# EAGLE design main (EAGLE 5.11)
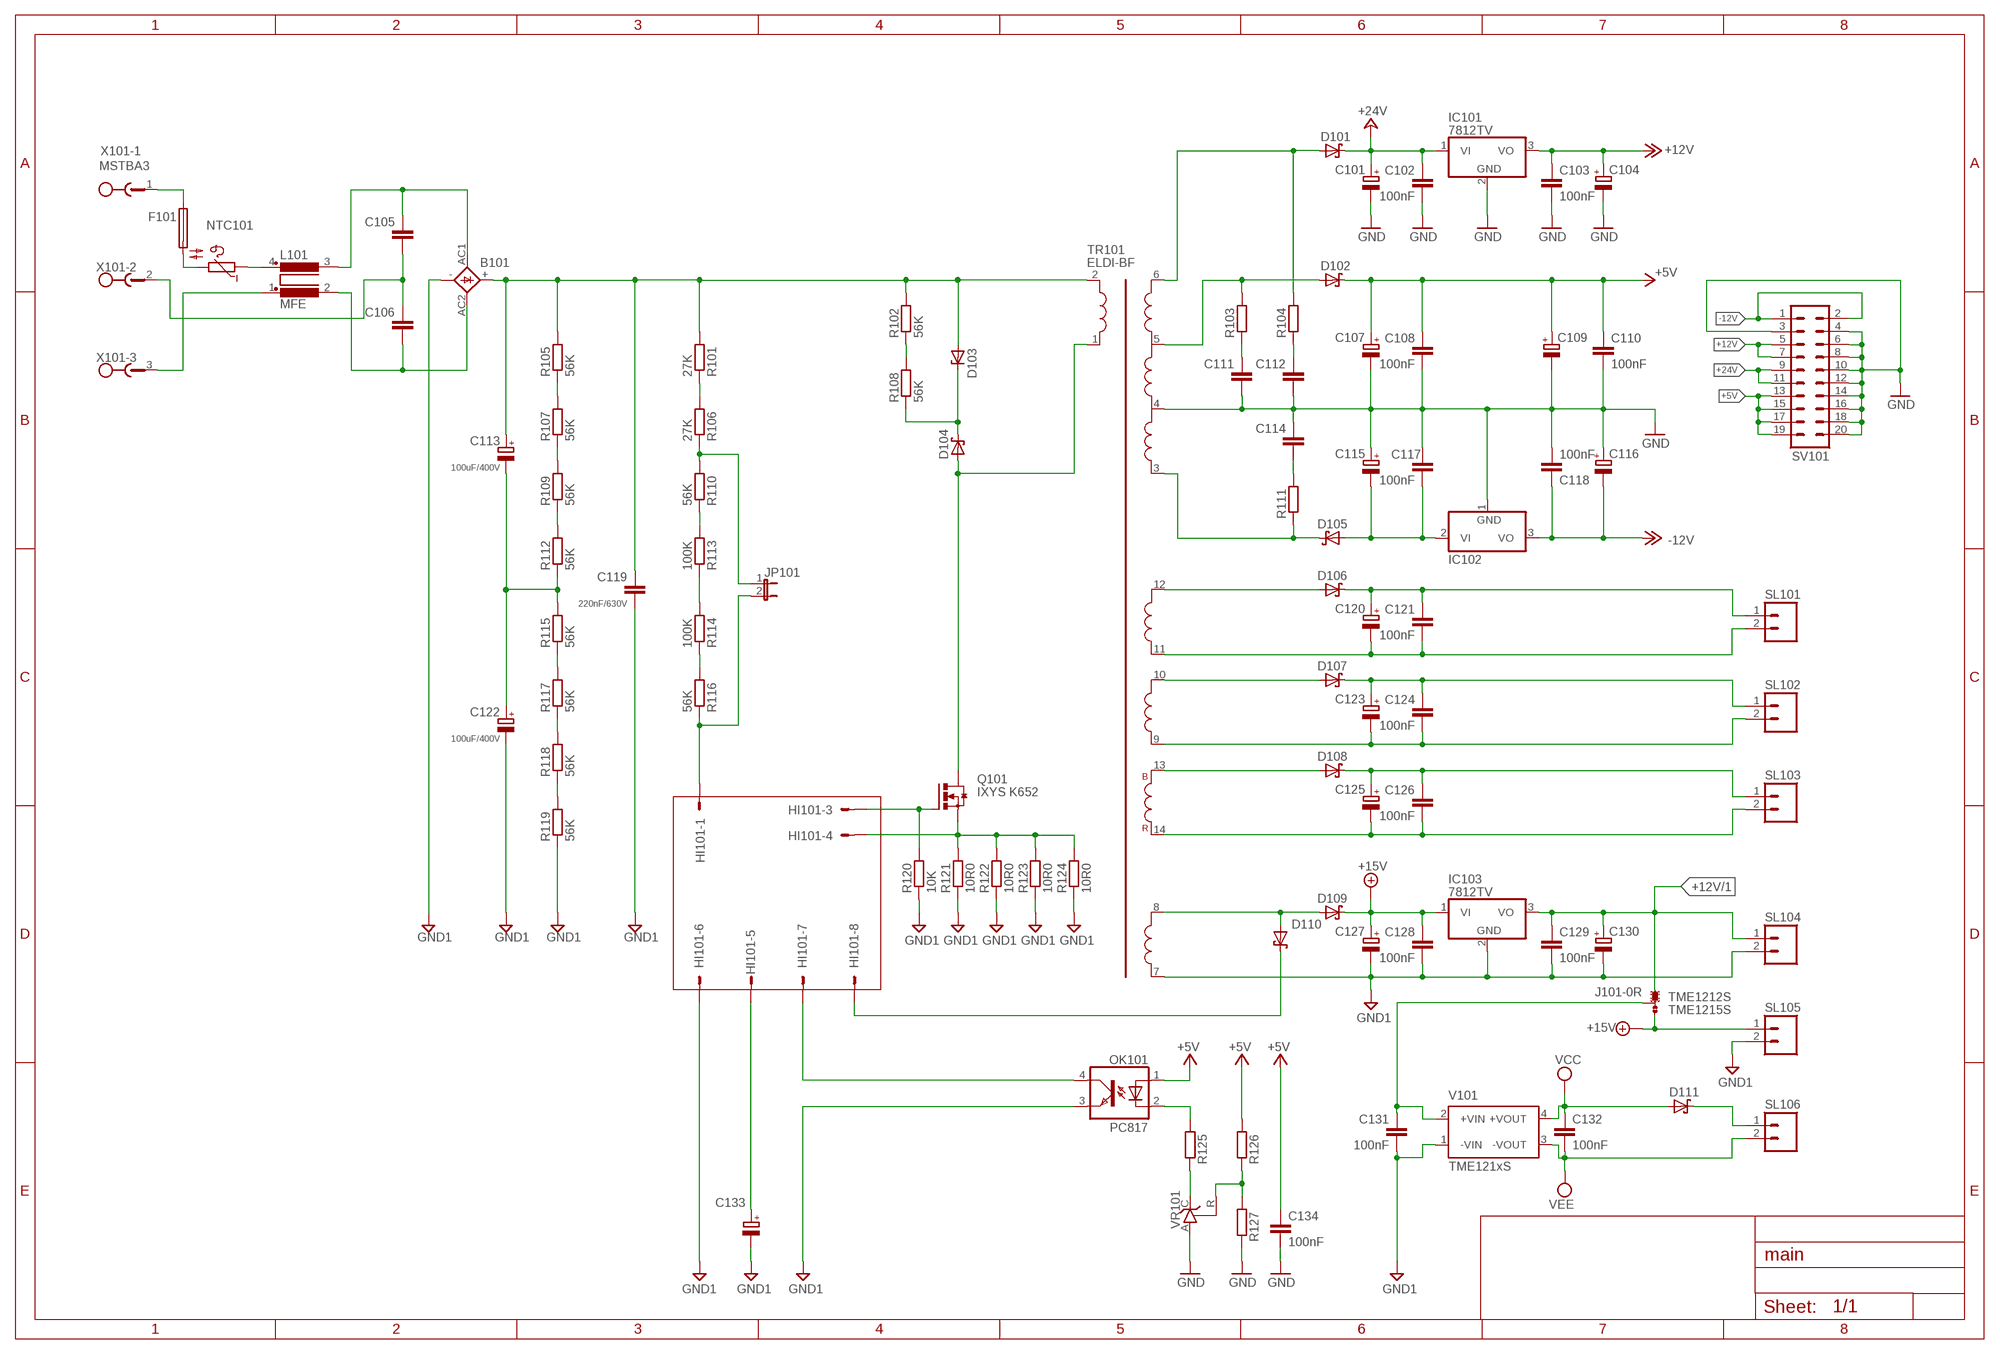
[diagram p0: schematic, sheet 1]

## Parts
B101  KBU  [KBU]
C101  CPOL-EUE3.5-10  [E3,5-10]
C102  100nF  C-EUC1206  [C1206]
C103  100nF  C-EUC1206  [C1206]
C104  CPOL-EUE3.5-10  [E3,5-10]
C105  C-EU102-054X133  [C102-054X133]
C106  C-EU102-054X133  [C102-054X133]
C107  CPOL-EUE3.5-10  [E3,5-10]
C108  100nF  C-EUC1206  [C1206]
C109  CPOL-EUE3.5-10  [E3,5-10]
C110  100nF  C-EUC1206  [C1206]
C111  C-EUC1206  [C1206]
C112  C-EUC1206  [C1206]
C113  100uF/400V  CPOL-EUE7.5-18  [E7,5-18]
C114  C-EUC1206  [C1206]
C115  CPOL-EUE3.5-10  [E3,5-10]
C116  CPOL-EUE3.5-10  [E3,5-10]
C117  100nF  C-EUC1206  [C1206]
C118  100nF  C-EUC1206  [C1206]
C119  220nF/630V  C-EU225-062X268  [C225-062X268]
C120  CPOL-EUE3.5-8  [E3,5-8]
C121  100nF  C-EUC1206  [C1206]
C122  100uF/400V  CPOL-EUE7.5-18  [E7,5-18]
C123  CPOL-EUE3.5-8  [E3,5-8]
C124  100nF  C-EUC1206  [C1206]
C125  CPOL-EUE3.5-8  [E3,5-8]
C126  100nF  C-EUC1206  [C1206]
C127  CPOL-EUE3.5-8  [E3,5-8]
C128  100nF  C-EUC1206  [C1206]
C129  100nF  C-EUC1206  [C1206]
C130  CPOL-EUE3.5-8  [E3,5-8]
C131  100nF  C-EUC1206  [C1206]
C132  100nF  C-EUC1206  [C1206]
C133  CPOL-EUE3.5-8  [E3,5-8]
C134  100nF  C-EUC1206  [C1206]
D101  SCHOTTKY-DIODESMD  [SMB]
D102  SCHOTTKY-DIODESMD  [SMB]
D103  ZENER-DIODESMB  [SMB]
D104  SCHOTTKY-DIODESMD  [SMB]
D105  SCHOTTKY-DIODESMD  [SMB]
D106  SCHOTTKY-DIODESMD  [SMB]
D107  SCHOTTKY-DIODESMD  [SMB]
D108  SCHOTTKY-DIODESMD  [SMB]
D109  SCHOTTKY-DIODESMD  [SMB]
D110  SCHOTTKY-DIODESMD  [SMB]
D111  SCHOTTKY-DIODESMD  [SMB]
F101  GSH15  [GSH15]
HI101  M08S  [08P]
IC101  7812TV  [TO220V]
IC102  7912T  [TO220H]
IC103  7812TV  7805TV  [TO220V]
J101  0R-JUMPA  [A0R-JMP]
JP101  JP1E  [JP1]
L101  MFE  [MFE]
NTC101  B57164  [B57164]
OK101  PC817  [DIL04]
Q101  IXYS K652  IRF3704S  [D2PACK]
R101  27K  R-EU_R1206  [R1206]
R102  56K  R-EU_R1206  [R1206]
R103  R-EU_R1206  [R1206]
R104  R-EU_R1206  [R1206]
R105  56K  R-EU_R1206  [R1206]
R106  27K  R-EU_R1206  [R1206]
R107  56K  R-EU_R1206  [R1206]
R108  56K  R-EU_R1206  [R1206]
R109  56K  R-EU_R1206  [R1206]
R110  56K  R-EU_R1206  [R1206]
R111  R-EU_R1206  [R1206]
R112  56K  R-EU_R1206  [R1206]
R113  100K  R-EU_R1206  [R1206]
R114  100K  R-EU_R1206  [R1206]
R115  56K  R-EU_R1206  [R1206]
R116  56K  R-EU_R1206  [R1206]
R117  56K  R-EU_R1206  [R1206]
R118  56K  R-EU_R1206  [R1206]
R119  56K  R-EU_R1206  [R1206]
R120  10K  R-EU_R1206  [R1206]
R121  10R0  R-EU_R1206  [R1206]
R122  10R0  R-EU_R1206  [R1206]
R123  10R0  R-EU_R1206  [R1206]
R124  10R0  R-EU_R1206  [R1206]
R125  R-EU_R1206  [R1206]
R126  R-EU_R1206  [R1206]
R127  R-EU_R1206  [R1206]
SL101  M02  [02P]
SL102  M02  [02P]
SL103  M02  [02P]
SL104  M02  [02P]
SL105  M02  [02P]
SL106  M02  [02P]
SV101  ML20  [ML20]
TR101  ELDI-BF  TRAF-ELDY-BFVAR1  [TRAF-ELDI-BF-VAR1]
V101  TME121xS  TME1215S  [TME]
VR101  TL431CLP  [TO92-CLP]
X101  MSTBA3  [MSTBA3]

## Nets
+5V: C107.+ C108.1 C109.+ C110.1 C134.1 D102.C OK101.1(A) R126.2 SV101.13 SV101.15 SV101.17 SV101.19
+12V: C103.1 C104.+ IC101.3(VO) SV101.5 SV101.7
+12V/1: C129.1 C130.+ IC103.3(VO) J101.1 SL104.1
+15V: C127.+ C128.1 D109.C IC103.1(VI) J101.3 SL105.1
+24V: C101.+ C102.1 D101.C IC101.1(VI) SV101.9 SV101.11
-12V: C116.- C118.1 IC102.3(VO) SV101.1 SV101.2
GND: C101.- C102.2 C103.2 C104.- C107.- C108.2 C109.- C110.2 C111.2 C112.2 C114.1 C115.+ C116.+ C117.2 C118.2 C134.2 IC101.2(GND) IC102.1(GND) R127.1 SV101.3 SV101.4 SV101.6 SV101.8 SV101.10 SV101.12 SV101.14 SV101.16 SV101.18 SV101.20 TR101.4 VR101.A
GND1: B101.- C119.2 C122.- C127.- C128.2 C129.2 C130.- C131.2 C133.- HI101.6 IC103.2(GND) OK101.3(EMIT) R119.1 R120.1 R121.1 R122.1 R123.1 R124.1 SL104.2 SL105.2 TR101.7 V101.1(-VIN)
N$1: F101.1 X101.1
N$2: L101.4 NTC101.1
N$3: L101.1 X101.3
N$4: B101.+ C113.+ C119.1 D103.A R101.2 R102.2 R105.2 TR101.2
N$6: C113.- C122.+ R112.1 R115.2
N$9: C115.- C117.1 D105.A IC102.2(VI)
N$10: D105.C R111.1 TR101.3
N$11: D101.A R104.2 TR101.6
N$12: R109.1 R112.2
N$13: D102.A R103.2 TR101.5
N$14: B101.AC2 C106.2 L101.2
N$15: B101.AC1 C105.1 L101.3
N$16: C114.2 R111.2
N$17: C111.1 R103.1
N$18: C112.1 R104.1
N$19: HI101.4 Q101.3(S) R121.2 R122.2 R123.2 R124.2
N$20: HI101.3 Q101.1(G) R120.2
N$21: D104.A Q101.2(D) TR101.1
N$22: D103.C D104.C R108.1
N$23: C105.2 C106.1 X101.2
N$24: R102.1 R108.2
N$25: D109.A D110.A TR101.8
N$26: D108.A TR101.13
N$27: D106.A TR101.12
N$28: R107.1 R109.2
N$30: D110.C HI101.8
N$32: D107.A TR101.10
N$33: R125.1 VR101.C
N$34: OK101.2(C) R125.2
N$35: R126.1 R127.2 VR101.R
N$36: JP101.1 R106.1 R110.2
N$37: HI101.7 OK101.4(COL)
N$38: R105.1 R107.2
N$39: R113.1 R114.2
N$40: R114.1 R116.2
N$41: R110.1 R113.2
N$42: HI101.1 JP101.2 R116.1
N$43: R101.1 R106.2
N$46: F101.2 NTC101.2
N$61: R115.1 R117.2
N$62: R117.1 R118.2
N$63: R118.1 R119.2
N$64: C133.+ HI101.5
N$83: C131.1 J101.2 V101.2(+VIN)
N$84: D111.C SL106.1
U+: C120.+ C121.1 D106.C SL101.1
U_GND: C120.- C121.2 SL101.2 TR101.11
V+: C123.+ C124.1 D107.C SL102.1
V_GND: C123.- C124.2 SL102.2 TR101.9
VCC: C132.1 D111.A V101.4(+VOUT)
VEE: C132.2 SL106.2 V101.3(-VOUT)
W+: C125.+ C126.1 D108.C SL103.1
W_GND: C125.- C126.2 SL103.2 TR101.14
Unconnected: HI101.2

## Notes on the sheet
- TME1212S
- TME1215S

## Library data of the parts
B101 = rectifier:KBU: DIOTEC RECTIFIER
C101 C104 C107 C109 C113 C115 C116 C120 C122 C123 C125 C127 C130 C133 = rcl:CPOL-EU: POLARIZED CAPACITOR, European symbol
C102 C103 C105 C106 C108 C110-C112 C114 C117-C119 C121 C124 C126 C128 C129 C131 C132 C134 = rcl:C-EU: CAPACITOR, European symbol
D101 D102 D104-D111 = diode:SCHOTTKY-DIODE: Schottky Diode
D103 = diode:ZENER-DIODE: Z-Diode
F101 = fuse:GSH15: FUSE HOLDER grid 15mm, 19649 Wickmann; MPN: 64900001039; OC_FARNELL: 1271673; OC_NEWARK: 02P0318
HI101 = con-amp-quick:M08S: AMP QUICK CONNECTOR; OC_FARNELL: unknown; OC_NEWARK: unknown
IC101 IC103 = linear:78*: Positive VOLTAGE REGULATOR Source: http://cache.national.com/ds/LM/LM78L05.pdf http://www.fairchildsemi.com/ds/LM/LM7805.pdf
IC102 = linear:79*: Negative VOLTAGE REGULATOR
J101 = jump-0r-smd:0R-JUMP: SMD 0R 0805 Jumper
JP101 = jumper:JP1E: JUMPER
L101 = inductors:MFE: FILTER
NTC101 = ptc-ntc:B57164: SIEMENS NTC; MPN: B57164K474K52; OC_FARNELL: 9753451; OC_NEWARK: 29M3118
OK101 = optocoupler:PC817: SHARP OPTO COUPLER; MPN: PC817X4J000F; OC_FARNELL: 9707727; OC_NEWARK: 97K7059
Q101 = transistor-power:IRF3704: SMPS MOSFET HEXFET® Power MOSFET Source: http://www.irf.com/product-info/datasheets/data/irf3704.pdf
R101-R127 = rcl:R-EU_: RESISTOR, European symbol
SL101-SL106 = con-amp-quick:M02: AMP QUICK CONNECTOR; OC_FARNELL: unknown; OC_NEWARK: unknown
SV101 = con-harting-ml:ML20: HARTING; OC_FARNELL: unknown; OC_NEWARK: unknown
TR101 = electroinvent:TRAF-ELDY-BF
V101 = traco-electronic:TME?*: DC/DC Converter TME Series 1 Watt Source: www.tracopower.com .. tme.pdf; MPN: TME 1215S; OC_FARNELL: 1007546; OC_NEWARK: 51R5328
VR101 = v-reg:TL431CLP: VOLTAGE REGULATOR
X101 = con-phoenix-508:MSTBA3: PHOENIX; MF: FARNELL; MPN: 1757255; OC_FARNELL: 3705183; OC_NEWARK: 71C4162

## Board
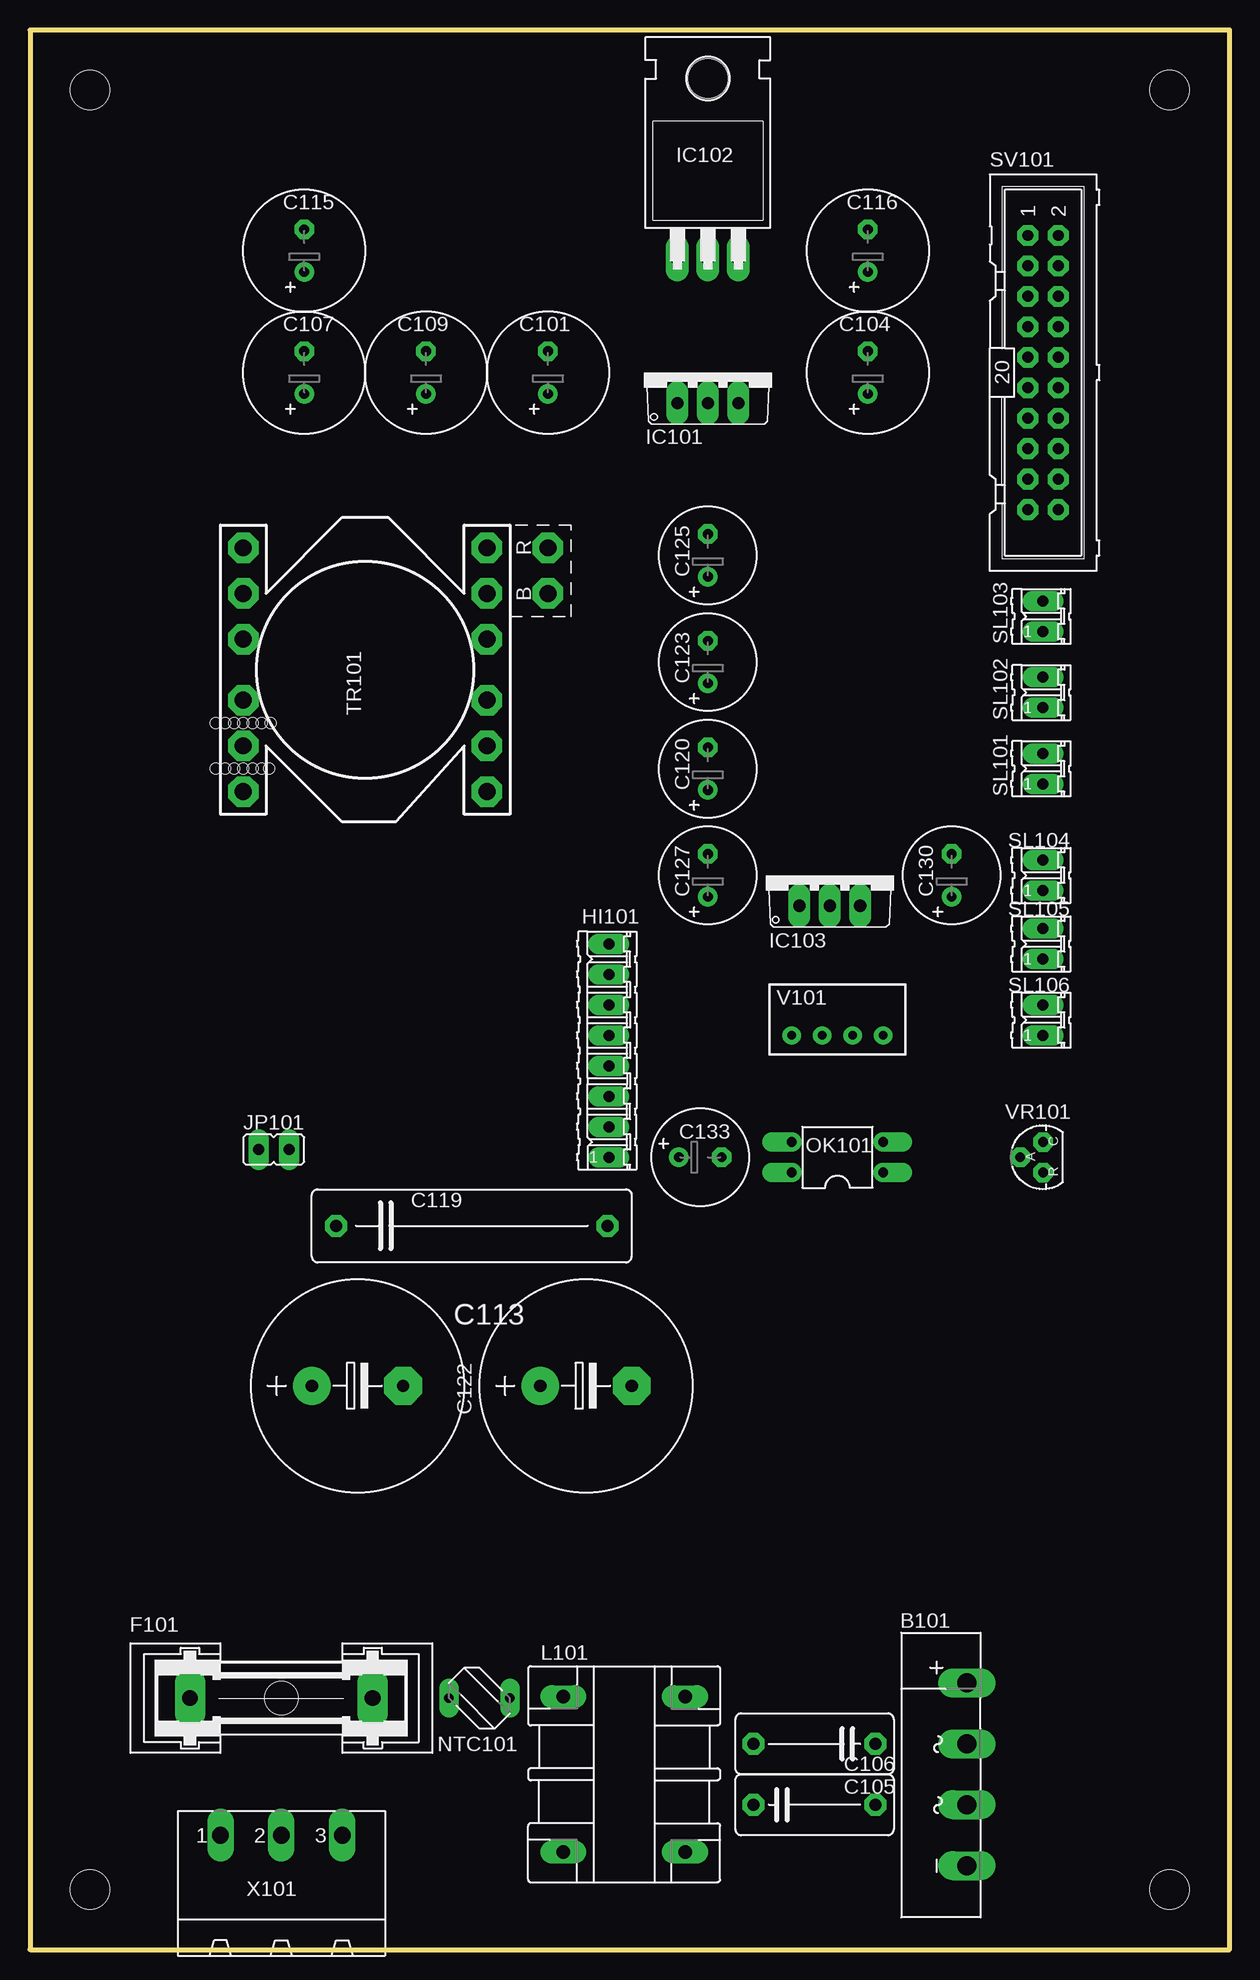
[diagram p1: board, top side]
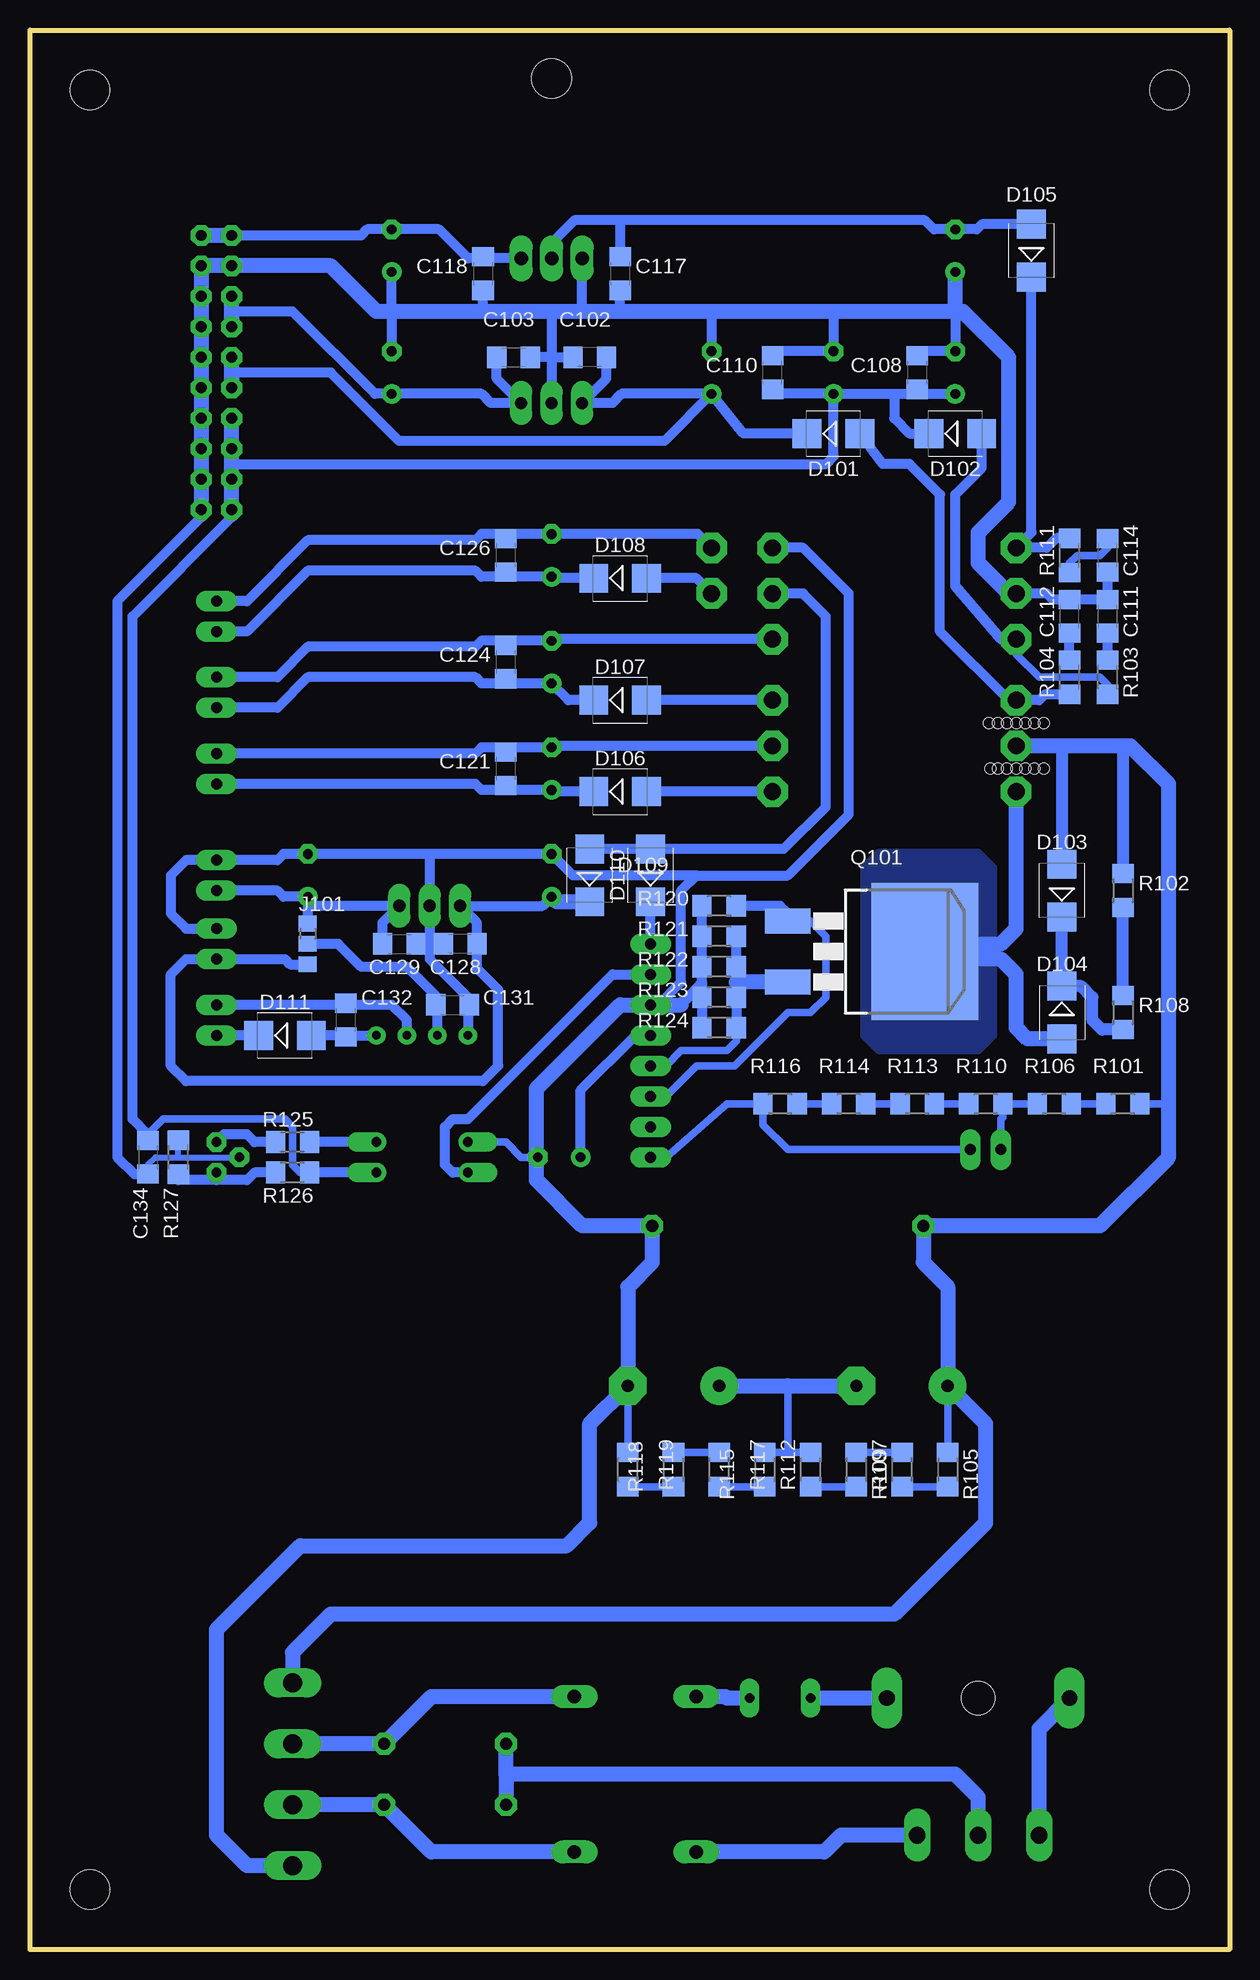
[diagram p2: board, bottom side, seen from below]

Size 100 x 160 mm. Coordinates in mm from the lower left corner, seen from the top.
Outline: 0,0 100,0 100,160 0,160 0,0
Copper layers (1*16): Top 0.035mm / dielectric 1.5mm / Bottom 0.035mm
Design rules "default *": minimum track width 10mil, minimum drill 0.9mm, track to track 8mil, track to pad 8mil, pad to pad 8mil, via to via 8mil, smd to smd 8mil, copper to edge 40mil, drill to drill 8mil, minimum pad ring 16mil, minimum via ring 10mil, stop-mask expansion 4mil, vias tented up to drill 0mil, thermal gap 10mil
Holes 0.9 mm at 17.78,102.23 17.02,102.23 18.54,102.23 19.3,102.23 20.07,102.23 16.26,102.23 15.49,102.23 17.78,98.42 17.02,98.42 16.26,98.42 15.49,98.42 18.54,98.42 19.3,98.42 19.94,98.42
Holes 3.3 mm at 5,5 95,5 95,155 5,155

### Footprints (pad centres in the part's own frame; a part is rotated, then mirrored left to right if it is on the bottom)
KBU = drill 1.6 long: + -7.62,2.54; - 7.62,2.54; AC1 -2.54,2.54; AC2 2.54,2.54
E3,5-10 = drill 0.813 pad 1.6 round: + -1.778,0 | drill 0.813 pad 1.6 octagon: - 1.778,0
C1206 = smd 1.6 x 1.8: 1 -1.4,0; 2 1.4,0
C102-054X133 = drill 1.016 octagon: 1 -5.08,0; 2 5.08,0
E7,5-18 = drill 1.016 pad 3.15 round: + -3.81,0 | drill 1.016 pad 3.15 octagon: - 3.81,0
C225-062X268 = drill 1.016 octagon: 1 -11.303,0; 2 11.303,0
E3,5-8 = drill 0.813 pad 1.6 round: + -1.778,0 | drill 0.813 pad 1.6 octagon: - 1.778,0
SMB = smd 2.4 x 2.4: A 2.2,0; C -2.2,0
GSH15 = drill 1.321 pad 2.54 long: 1 -7.62,0; 2 7.62,0 | hole 2.794: 0,0
08P = drill 0.914 long: 1 -8.89,0; 2 -6.35,0; 3 -3.81,0; 4 -1.27,0; 5 1.27,0; 6 3.81,0; 7 6.35,0; 8 8.89,0
TO220V = drill 1.016 long: 1 -2.54,-2.54; 2 0,-2.54; 3 2.54,-2.54
TO220H = drill 1.118 long: 1 -2.54,-10.16; 2 0,-10.16; 3 2.54,-10.16 | hole 3.302: 0,4.826
A0R-JMP = smd 1.5 x 1.3: 1 0,1.7; 2 0,0; 3 0,-1.7
JP1 = drill 0.914 long: 1 0,-1.27; 2 0,1.27
MFE = drill 1.118 long: 1 6.477,-5.08; 2 6.477,5.08; 3 -6.477,5.08; 4 -6.477,-5.08
B57164 = drill 0.813 long: 1 -2.54,0; 2 2.54,0
DIL04 = drill 0.813 offset: 1 -1.27,-3.81; 2 1.27,-3.81; 3 1.27,3.81; 4 -1.27,3.81
D2PACK = smd 2.083 x 3.81: 1 -2.54,-8.89; 3 2.54,-8.89 | smd 11.43 x 8.89: 2 0,2.54
R1206 = smd 1.6 x 1.803: 1 -1.422,0; 2 1.422,0
02P = drill 0.914 long: 1 -1.27,0; 2 1.27,0
ML20 = drill 0.914 octagon: 1 -11.43,-1.27; 2 -11.43,1.27; 3 -8.89,-1.27; 4 -8.89,1.27; 5 -6.35,-1.27; 6 -6.35,1.27; 7 -3.81,-1.27; 8 -3.81,1.27; 9 -1.27,-1.27; 10 -1.27,1.27; 11 1.27,-1.27; 12 1.27,1.27; 13 3.81,-1.27; 14 3.81,1.27; 15 6.35,-1.27; 16 6.35,1.27; 17 8.89,-1.27; 18 8.89,1.27; 19 11.43,-1.27; 20 11.43,1.27
TRAF-ELDI-BF-VAR1 = drill 1.4 octagon: 1 -10.16,10.16; 2 -6.35,10.16; 3 10.16,10.16; 4 6.35,10.16; 5 2.54,10.16; 6 -2.54,10.16; 7 10.16,-10.16; 8 6.35,-10.16; 9 2.54,-10.16; 10 -2.54,-10.16; 11 -6.35,-10.16; 12 -10.16,-10.16; 13 6.35,-15.24; 14 10.16,-15.24
TME = drill 0.7 pad 1.1 round: 1 -3.81,0; 2 -1.27,0; 3 1.27,0; 4 3.81,0
TO92-CLP = drill 0.813 octagon: A 0,1.905; C 1.27,0; R -1.27,0
MSTBA3 = drill 1.397 long: 1 -5.08,5.08; 2 0,5.08; 3 5.08,5.08

### Placement (x,y rotation side)
B101  75.56,14.61 270 top
C101  43.18,131.44 90 top
C102  53.34,132.72 180 bottom
C103  59.69,132.72 0 bottom
C104  69.85,131.44 90 top
C105  65.41,17.14 180 top
C106  65.41,12.06 0 top
C107  22.86,131.44 90 top
C108  26.04,131.44 90 bottom
C109  33.02,131.44 90 top
C110  38.1,131.44 90 bottom
C111  10.16,111.12 90 bottom
C112  13.34,111.12 90 bottom
C113  27.3,46.99 0 top
C114  10.16,116.2 90 bottom
C115  22.86,141.6 90 top
C116  69.85,141.6 90 top
C117  50.8,139.7 270 bottom
C118  62.23,139.7 270 bottom
C119  36.83,60.33 0 top
C120  56.52,98.42 90 top
C121  60.33,98.42 90 bottom
C122  46.35,46.99 0 top
C123  56.52,107.31 90 top
C124  60.33,107.31 90 bottom
C125  56.52,116.2 90 top
C126  60.33,116.2 90 bottom
C127  56.52,89.53 90 top
C128  64.14,83.82 180 bottom
C129  69.22,83.82 0 bottom
C130  76.83,89.53 90 top
C131  64.77,78.74 0 bottom
C132  73.66,77.47 90 bottom
C133  55.88,66.04 0 top
C134  90.17,66.04 270 bottom
D101  33.02,126.36 0 bottom
D102  22.86,126.36 0 bottom
D103  13.97,88.27 90 bottom
D104  13.97,78.11 270 bottom
D105  16.51,141.6 90 bottom
D106  50.8,96.52 0 bottom
D107  50.8,104.14 0 bottom
D108  50.8,114.3 0 bottom
D109  53.34,89.53 90 bottom
D110  48.26,89.53 90 bottom
D111  78.74,76.2 0 bottom
F101  20.95,20.95 0 top
HI101  48.26,74.93 90 top
IC101  56.52,131.44 0 top
IC102  56.52,151.13 0 top
IC103  66.67,89.53 0 top
J101  76.83,83.82 0 bottom
JP101  20.32,66.67 270 top
L101  49.53,14.61 270 top
NTC101  37.47,20.95 180 top
OK101  67.31,66.04 90 top
Q101  27.94,83.19 270 bottom
R101  8.89,70.48 0 bottom
R102  8.89,88.27 90 bottom
R103  10.16,106.05 270 bottom
R104  13.34,106.05 270 bottom
R105  23.5,40.01 90 bottom
R106  14.61,70.48 0 bottom
R107  27.3,40.01 270 bottom
R108  8.89,78.11 90 bottom
R109  31.11,40.01 90 bottom
R110  20.32,70.48 0 bottom
R111  13.34,116.2 270 bottom
R112  34.92,40.01 270 bottom
R113  26.04,70.48 0 bottom
R114  31.75,70.48 0 bottom
R115  38.73,40.01 90 bottom
R116  37.47,70.48 0 bottom
R117  42.55,40.01 270 bottom
R118  46.35,40.01 90 bottom
R119  50.16,40.01 270 bottom
R120  42.55,87 0 bottom
R121  42.55,84.45 0 bottom
R122  42.55,81.92 0 bottom
R123  42.55,79.38 0 bottom
R124  42.55,76.83 0 bottom
R125  78.11,67.31 0 bottom
R126  78.11,64.77 0 bottom
R127  87.63,66.04 270 bottom
SL101  84.45,98.42 90 top
SL102  84.45,104.78 90 top
SL103  84.45,111.12 90 top
SL104  84.45,89.53 90 top
SL105  84.45,83.82 90 top
SL106  84.45,77.47 90 top
SV101  84.45,131.44 270 top
TR101  27.94,106.68 90 top
V101  67.31,76.2 0 top
VR101  84.45,66.04 90 top
X101  20.95,4.45 0 top

### Tracks (layer width: path | path; a pad name or v marks a point on that pad's centre or on a via)
+5V
  Bottom 0.61: R126.2 77.47,64.77 78.11,65.41 78.11,68.58 78.74,69.22 88.9,69.22 90.17,67.94
  Bottom 0.813: 26.04,129.67 C107.+ | C109.+ 27.94,129.67 | 27.94,129.67 26.04,129.67 | C109.+ 37.72,129.67 C110.1 | 26.04,129.67 C108.1 | C109.+ 33.02,124.46 33.66,123.83 83.19,123.83 | SV101.19 83.19,119.38 91.44,111.12 91.44,69.22 90.17,67.94 C134.1 | OK101.1 R126.2 | D102.C 26.67,126.36 27.94,127.64 27.94,129.67
  Bottom 1.27: SV101.19 SV101.17 83.19,123.83 SV101.15 SV101.13
+12V
  Bottom 0.813: C103.1 61.09,130.94 IC101.3 61.59,128.91 62.36,129.67 C104.+ 71.25,129.67 78.11,136.53 83.19,136.53
  Bottom 1.27: SV101.5 SV101.7 83.19,136.53
+12V/1
  Bottom 0.813: C130.+ 76.71,87 IC103.3 70.61,85.59 C129.1 | C130.+ 78.87,87.76 79.38,88.27 SL104.1 | C130.+ J101.1
+15V
  Bottom 0.813: C127.+ 57.28,87 IC103.1 62.73,85.59 C128.1 62.73,81.78 60.96,80.01 60.96,73.66 62.23,72.39 87,72.39 88.27,73.66 88.27,81.28 87,82.55 SL105.1 78.74,82.55 78.31,82.12 J101.3
  Bottom 1.27: D109.C 56.09,87.33 C127.+
+24V
  Bottom 0.813: D101.C 40.51,126.36 C101.+ | C101.+ 50.67,129.67 51.44,128.91 IC101.1 51.94,130.94 C102.1 | C101.+ 47.12,125.73 69.22,125.73 74.93,131.44 83.19,131.44
  Bottom 1.27: SV101.9 SV101.11 83.19,131.44
-12V
  Bottom 0.813: IC102.3 62.23,140.97 | 62.23,140.97 63.5,140.97 65.91,143.38 C116.- 71.88,143.38 72.39,142.88 SV101.1 | 62.23,140.97 C118.1
  Bottom 1.27: SV101.1 SV101.2
GND  (via drill 1.4 pad 2.54)
  Bottom 0.508: 87.63,66.04 89.53,66.04 90.17,65.41 C134.2 | 87.63,66.04 VR101.A | 87.63,66.04 R127.1
  Bottom 0.813: C114.1 C111.2 C112.2 14.73,112.53 15.24,113.03 TR101.4 | C108.2 25.66,133.22 C107.- 22.86,136.53 | C110.2 37.72,133.22 C109.- 33.02,136.53 | 43.18,136.53 C101.- | 56.52,136.53 56.52,132.72 | 56.52,132.72 IC101.2 | 56.52,132.72 C102.2 | 56.52,132.72 C103.2 | C104.- 69.85,136.53 C116.+ | 53.98,136.53 IC102.1 | SV101.20 85.72,119.38 92.71,112.39 92.71,66.04 91.31,64.64 C134.2 | 50.8,136.53 C117.2 | 62.23,136.53 C118.2
  Bottom 1.27: TR101.4 18.41,113.03 20.95,115.57 20.95,118.11 18.41,120.65 18.41,132.72 22.23,136.53 22.86,136.53 | 22.86,136.53 33.02,136.53 43.18,136.53 50.8,136.53 53.98,136.53 56.52,136.53 62.23,136.53 69.85,136.53 71.12,136.53 74.93,140.34 SV101.3 SV101.4 SV101.6 SV101.8 SV101.10 SV101.12 SV101.14 SV101.16 SV101.18 SV101.20 | 22.86,136.53 C115.+
  other vias: 17.78,113.03
GND1  (via drill 1.4 pad 2.54)
  Bottom 0.61: 57.78,66.04 59.05,66.04 60.33,67.31 OK101.3 | C122.- R119.1
  Bottom 0.813: R124.1 R123.1 43.97,80.64 | R120.1 R121.1 R122.1 43.97,80.64 | 45.72,78.74 43.97,80.64 | TR101.7 35.56,116.84 31.75,113.03 31.75,94.61 36.83,89.53 44.45,89.53 | 44.45,89.53 54.74,89.53 C127.- 66.67,91.31 | 66.67,91.31 C130.- 78.87,91.31 79.38,90.81 SL104.2 87,90.81 88.27,89.53 88.27,86.36 87,85.09 SL105.2 | 66.67,91.31 IC103.2 66.67,83.82 | 66.67,83.82 C128.2 | 66.67,83.82 C129.2 | HI101.6 47.62,78.74 45.72,80.64 45.72,88.27 44.45,89.53 | 66.67,83.82 66.67,82.55 63.5,79.38 63.5,78.74 V101.1
  Bottom 1.27: 45.72,78.74 HI101.6 50.8,78.74 57.78,71.75 57.78,66.04 | 57.78,66.04 57.78,64.14 53.98,60.33 C119.2 48.13,57.28 50.16,55.24 C122.- 53.34,43.81 53.34,35.56 55.24,33.66 77.47,33.66 84.45,26.67 84.45,9.53 81.92,6.99 B101.- | 63.5,78.74 C131.2 | 57.78,66.04 C133.-
  other vias: 38.1,116.84
N$1
  Bottom 1.27: X101.1 15.88,18.41 F101.1
N$2
  Bottom 1.27: NTC101.1 41.91,20.95 42.04,21.08 L101.4
N$3
  Bottom 1.27: X101.3 32.38,9.53 33.78,8.13 L101.1
N$4  (via drill 1.4 pad 2.54)
  Bottom 0.61: 5.08,70.48 R101.2 | C113.+ R105.2
  Bottom 1.016: 13.97,100.33 D103.A | 8.89,100.33 R102.2
  Bottom 1.27: TR101.2 13.97,100.33 8.89,100.33 8.26,100.33 5.08,97.16 5.08,70.48 5.08,66.04 10.79,60.33 C119.1 25.53,57.28 23.5,55.24 C113.+ 20.32,43.81 20.32,35.56 27.94,27.94 74.93,27.94 78.11,24.77 B101.+
  other vias: 17.78,100.33
N$6
  Bottom 0.61: R112.1 36.83,41.43 | 36.83,41.43 R115.2 | 36.83,41.43 36.83,46.99
  Bottom 1.27: C113.- 36.83,46.99 C122.+
N$9
  Bottom 0.813: 50.8,144.15 25.4,144.15 24.64,143.38 C115.- 21.08,143.38 20.66,143.81 D105.A | 50.8,144.15 54.61,144.15 56.52,142.24 IC102.2 | 50.8,144.15 C117.1
N$10  (via drill 1.4 pad 2.54)
  Bottom 0.813: R111.1 14.45,117.63 15.24,116.84 TR101.3 16.51,118.11 D105.C
  other vias: 17.78,116.84
N$11  (via drill 1.4 pad 2.54)
  Bottom 0.813: R104.2 15.39,104.62 15.88,104.14 TR101.6 18.41,104.14 24.13,109.86 24.13,121.28 26.67,123.83 28.91,123.83 D101.A
  other vias: 17.78,104.14
N$12
  Bottom 0.61: R109.1 R112.2
N$13  (via drill 1.4 pad 2.54)
  Bottom 0.61: R103.2 10.16,105.41 10.79,106.05 15.88,106.05 17.78,107.95 TR101.5
  Bottom 0.813: TR101.5 19.05,109.22 22.86,113.67 22.86,121.28 20.66,123.48 D102.A
  other vias: 17.78,109.22
N$14
  Bottom 1.27: B101.AC2 C106.2 66.55,8.13 L101.2
N$15
  Bottom 1.27: B101.AC1 C105.1 66.55,21.08 L101.3
N$16
  Bottom 0.61: R111.2 13.34,115.57 12.7,116.2 10.79,116.2 10.16,116.84 C114.2
N$17
  Bottom 0.813: R103.1 C111.1
N$18
  Bottom 0.813: R104.1 C112.1
N$19
  Bottom 0.61: HI101.4 46.99,73.66 45.72,74.93 41.91,74.93 41.12,75.72 R124.2
  Bottom 0.813: R124.2 R123.2 41.12,80.64 R122.2 R121.2
  Bottom 1.27: Q101.3 41.12,80.64
N$20
  Bottom 0.61: HI101.3 46.99,71.12 44.45,73.66 41.27,73.66 36.83,78.11 34.92,78.11 33.66,79.38 33.66,84.45 34.92,85.72 Q101.1
  Bottom 0.813: Q101.1 36.83,86.36 37.47,87 R120.2
N$21  (via drill 1.4 pad 2.54)
  Bottom 1.016: 24.77,83.82 Q101.2 24.77,82.55
  Bottom 1.27: TR101.1 17.78,85.09 19.05,83.82 24.77,83.82 | D104.A 16.85,75.91 17.78,76.83 17.78,81.28 19.05,82.55 24.77,82.55
  other vias: 17.78,96.52
  pour Bottom (isolate 0.61, no thermals): 19.68,76.2 19.68,90.17 20.95,91.44 29.21,91.44 30.48,90.17 30.48,76.2 29.21,74.93 20.95,74.93
N$22
  Bottom 1.016: D103.C D104.C 12.36,80.31 11.43,79.38 11.43,77.47 10.64,76.68 R108.1
N$23
  Bottom 1.27: 60.33,14.61 C106.1 | 60.33,14.61 22.86,14.61 20.95,12.7 X101.2 | 60.33,14.61 C105.2
N$24
  Bottom 1.016: R108.2 R102.1
N$25  (via drill 1.4 pad 2.54)
  Bottom 0.813: TR101.8 35.56,113.03 33.66,111.12 33.66,95.25 37.17,91.73 D110.A D109.A
  other vias: 38.1,113.03
N$26  (via drill 1.4 pad 2.54)
  Bottom 0.813: TR101.13 44.45,114.3 D108.A
  other vias: 43.18,113.03
N$27  (via drill 1.4 pad 2.54)
  Bottom 0.813: TR101.12 D106.A
  other vias: 38.1,96.52
N$28
  Bottom 0.61: R109.2 R107.1
N$30
  Bottom 0.813: HI101.8 D110.C
N$32  (via drill 1.4 pad 2.54)
  Bottom 0.813: TR101.10 D107.A
  other vias: 38.1,104.14
N$33
  Bottom 0.813: R125.1 81.28,67.31 81.92,67.94 83.82,67.94 VR101.C
N$34
  Bottom 0.813: OK101.2 R125.2
N$35
  Bottom 0.813: R126.1 81.28,64.77 81.92,64.14 84.45,64.14 | 84.45,64.14 VR101.R | R127.2 87.63,64.14 84.45,64.14
N$36
  Bottom 0.61: R106.1 R110.2 18.9,69.37 19.05,69.22 JP101.1
N$37
  Bottom 0.813: HI101.7 51.44,81.28 63.5,69.22 64.77,69.22 65.41,68.58 65.41,65.41 64.77,64.77 OK101.4
N$38
  Bottom 0.61: R105.1 R107.2
N$39
  Bottom 0.61: R113.1 R114.2
N$40
  Bottom 0.61: R114.1 R116.2
N$41
  Bottom 0.61: R110.1 R113.2
N$42
  Bottom 0.61: HI101.1 46.99,66.04 41.91,70.48 R116.1 38.89,68.73 36.83,66.67 JP101.2
N$43
  Bottom 0.61: R101.1 R106.2
N$46
  Bottom 1.27: F101.2 NTC101.2
N$61
  Bottom 0.61: R115.1 R117.2
N$62
  Bottom 0.61: R117.1 R118.2
N$63
  Bottom 0.61: R118.1 R119.2
N$64
  Bottom 0.813: C133.+ 54.1,71.63 49.53,76.2 HI101.5
N$83
  Bottom 0.813: J101.2 74.3,83.82 72.39,81.92 68.58,81.92 66.04,79.38 66.04,78.74 V101.2
  Bottom 1.27: 66.04,78.74 C131.1
N$84
  Bottom 0.813: D111.C SL106.1
U+
  Bottom 0.813: D106.C 56.39,96.52 | C120.+ 60.33,96.65 | 60.33,96.65 62.36,96.65 62.87,97.16 SL101.1 | 60.33,96.65 C121.1
  Bottom 1.27: 56.39,96.52 C120.+
U_GND  (via drill 1.4 pad 2.54)
  Bottom 0.813: TR101.11 56.39,100.33 | C120.- 60.33,100.2 | 60.33,100.2 62.36,100.2 62.87,99.69 SL101.2 | 60.33,100.2 C121.2
  Bottom 1.27: 56.39,100.33 C120.-
  other vias: 38.1,100.33
V+
  Bottom 0.813: D107.C 55.12,104.14 C123.+ 60.33,105.54 | SL102.1 79.38,103.5 76.83,106.05 62.87,106.05 62.36,105.54 60.33,105.54 | 60.33,105.54 C124.1
V_GND  (via drill 1.4 pad 2.54)
  Bottom 0.813: SL102.2 79.38,106.05 76.83,108.58 62.87,108.58 62.36,109.09 60.33,109.09 | C123.- 60.33,109.09 | 60.33,109.09 C124.2 | TR101.9 56.39,109.22
  Bottom 1.27: 56.39,109.22 C123.-
  other vias: 38.1,109.22
VCC
  Bottom 0.813: V101.4 73.66,76.2 D111.A
  Bottom 1.27: C132.1 73.66,76.2
VEE
  Bottom 0.813: V101.3 68.58,77.47 69.85,78.74 73.66,78.74 SL106.2
  Bottom 1.27: 73.66,78.74 C132.2
W+
  Bottom 0.813: D108.C 56.39,114.3 | SL103.1 81.92,109.86 76.83,114.94 62.87,114.94 62.36,114.43 60.33,114.43 | C125.+ 60.33,114.43 | 60.33,114.43 C126.1
  Bottom 1.27: 56.39,114.3 C125.+
W_GND  (via drill 1.4 pad 2.54)
  Bottom 0.813: TR101.14 44.32,117.98 C125.- 60.33,117.98 | SL103.2 81.92,112.39 76.83,117.47 62.87,117.47 62.36,117.98 60.33,117.98 | 60.33,117.98 C126.2
  other vias: 43.18,116.84